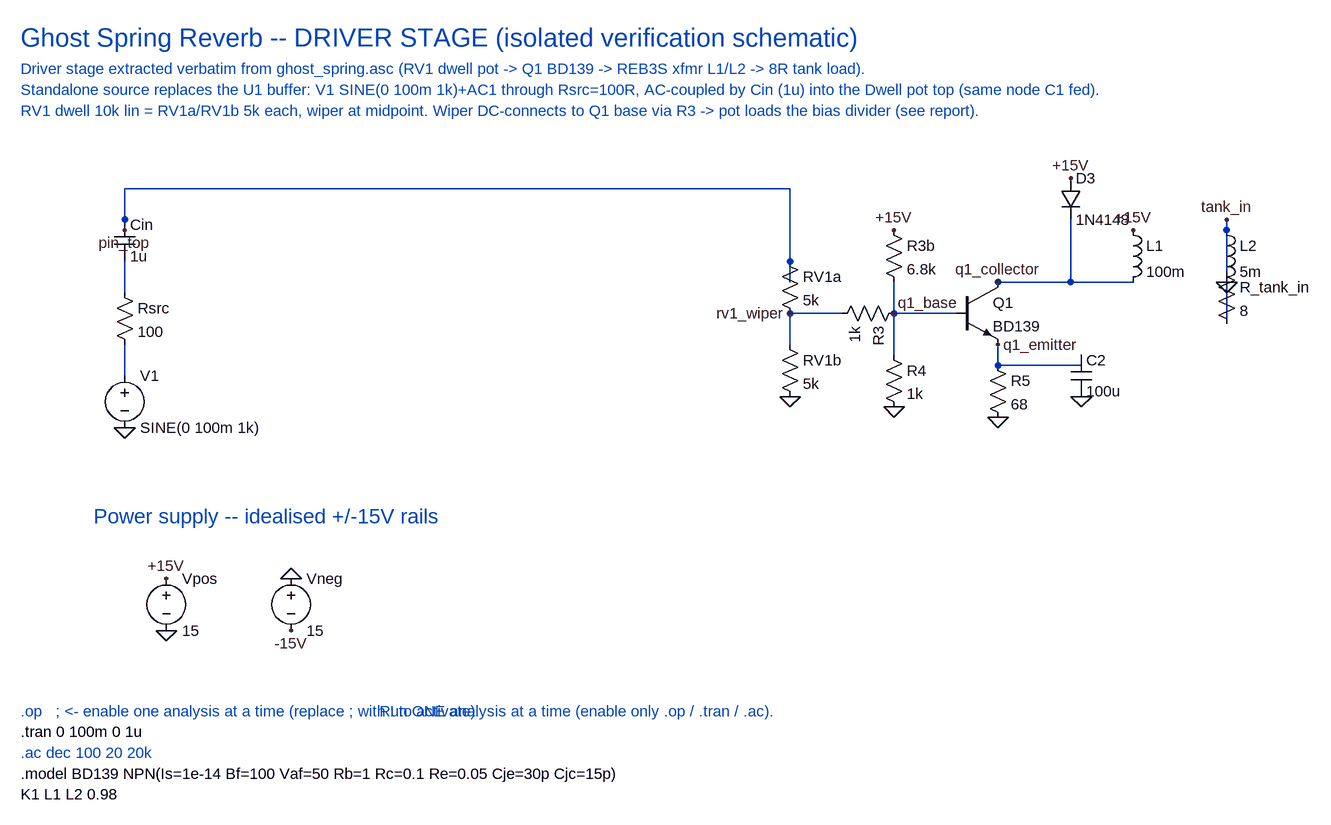
[diagram p0: schematic driver_stage.asc]
driver_stage.asc, the LTspice schematic file:
Version 4
SHEET 1 2400 1200
TEXT 48 24 Left 4 Ghost Spring Reverb -- DRIVER STAGE (isolated verification schematic)
TEXT 48 72 Left 2 Driver stage extracted verbatim from ghost_spring.asc (RV1 dwell pot -> Q1 BD139 -> REB3S xfmr L1/L2 -> 8R tank load).
TEXT 48 104 Left 2 Standalone source replaces the U1 buffer: V1 SINE(0 100m 1k)+AC1 through Rsrc=100R, AC-coupled by Cin (1u) into the Dwell pot top (same node C1 fed).
TEXT 48 136 Left 2 RV1 dwell 10k lin = RV1a/RV1b 5k each, wiper at midpoint. Wiper DC-connects to Q1 base via R3 -> pot loads the bias divider (see report).
SYMBOL cap 192 304 R0
SYMATTR InstName Cin
SYMATTR Value 1u
FLAG 208 320 pin_top
SYMBOL res 192 400 R0
SYMATTR InstName Rsrc
SYMATTR Value 100
SYMBOL voltage 208 528 R0
WINDOW 3 24 96 Left 2
SYMATTR InstName V1
SYMATTR Value SINE(0 100m 1k)
SYMATTR Value2 AC 1
FLAG 208 624 0
WIRE 208 368 208 416
WIRE 208 496 208 544
WIRE 208 320 208 256
WIRE 208 256 1232 256
WIRE 1232 256 1232 368
SYMBOL res 1216 352 R0
SYMATTR InstName RV1a
SYMATTR Value 5k
WIRE 1232 368 1232 400
FLAG 1232 448 rv1_wiper
SYMBOL res 1216 480 R0
SYMATTR InstName RV1b
SYMATTR Value 5k
WIRE 1232 448 1232 496
FLAG 1232 576 0
SYMBOL res 1408 432 R90
SYMATTR InstName R3
SYMATTR Value 1k
WIRE 1232 448 1312 448
FLAG 1392 448 q1_base
SYMBOL res 1376 304 R0
SYMATTR InstName R3b
SYMATTR Value 6.8k
FLAG 1392 320 +15V
WIRE 1392 400 1392 448
SYMBOL res 1376 496 R0
SYMATTR InstName R4
SYMATTR Value 1k
WIRE 1392 448 1392 512
FLAG 1392 592 0
SYMBOL npn 1488 400 R0
SYMATTR InstName Q1
SYMATTR Value BD139
WIRE 1392 448 1488 448
FLAG 1552 496 q1_emitter
FLAG 1552 400 q1_collector
SYMBOL res 1536 512 R0
SYMATTR InstName R5
SYMATTR Value 68
WIRE 1552 496 1552 528
FLAG 1552 608 0
SYMBOL cap 1664 512 R0
SYMATTR InstName C2
SYMATTR Value 100u
WIRE 1552 528 1680 528
WIRE 1680 528 1680 512
FLAG 1680 576 0
SYMBOL diode 1648 240 R0
SYMATTR InstName D3
SYMATTR Value 1N4148
FLAG 1664 240 +15V
WIRE 1664 304 1664 400
WIRE 1552 400 1664 400
SYMBOL ind 1744 304 R0
SYMATTR InstName L1
SYMATTR Value 100m
SYMATTR SpiceLine Rser=0
FLAG 1760 320 +15V
WIRE 1552 400 1760 400
SYMBOL ind 1888 304 R0
SYMATTR InstName L2
SYMATTR Value 5m
SYMATTR SpiceLine Rser=0
FLAG 1904 400 0
FLAG 1904 304 tank_in
WIRE 1904 304 1904 320
SYMBOL res 1888 368 R0
SYMATTR InstName R_tank_in
SYMATTR Value 8
WIRE 1904 320 1904 384
WIRE 1904 464 1904 400
TEXT 160 760 Left 3 Power supply -- idealised +/-15V rails
SYMBOL voltage 272 840 R0
SYMATTR InstName Vpos
SYMATTR Value 15
FLAG 272 856 +15V
FLAG 272 936 0
SYMBOL voltage 464 840 R0
SYMATTR InstName Vneg
SYMATTR Value 15
FLAG 464 856 0
FLAG 464 936 -15V
TEXT 48 1060 Left 2 ;.op   ; <- enable one analysis at a time (replace ; with ! to activate)
TEXT 48 1092 Left 2 !.tran 0 100m 0 1u
TEXT 48 1124 Left 2 ;.ac dec 100 20 20k
TEXT 48 1156 Left 2 !.model BD139 NPN(Is=1e-14 Bf=100 Vaf=50 Rb=1 Rc=0.1 Re=0.05 Cje=30p Cjc=15p)
TEXT 48 1188 Left 2 !K1 L1 L2 0.98
TEXT 600 1060 Left 2 Run ONE analysis at a time (enable only .op / .tran / .ac).

The netlist it stands for:
* driver_stage.asc
Cin pin_top N001 1u
Rsrc N001 N002 100
V1 N002 0 SINE(0 100m 1k) AC 1
RV1a pin_top rv1_wiper 5k
RV1b rv1_wiper 0 5k
R3 q1_base rv1_wiper 1k
R3b +15V q1_base 6.8k
R4 q1_base 0 1k
Q1 q1_collector q1_base q1_emitter 0 BD139
R5 q1_emitter 0 68
C2 q1_emitter 0 100u
D3 +15V q1_collector 1N4148
L1 +15V q1_collector 100m Rser=0
L2 tank_in 0 5m Rser=0
R_tank_in tank_in 0 8
Vpos +15V 0 15
Vneg 0 -15V 15
.model D D
.lib standard.dio
.model NPN NPN
.model PNP PNP
.lib standard.bjt
* Ghost Spring Reverb -- DRIVER STAGE (isolated verification schematic)
* Driver stage extracted verbatim from ghost_spring.asc (RV1 dwell pot -> Q1 BD139 -> REB3S xfmr L1/L2 -> 8R tank load).
* Standalone source replaces the U1 buffer: V1 SINE(0 100m 1k)+AC1 through Rsrc=100R, AC-coupled by Cin (1u) into the Dwell pot top (same node C1 fed).
* RV1 dwell 10k lin = RV1a/RV1b 5k each, wiper at midpoint. Wiper DC-connects to Q1 base via R3 -> pot loads the bias divider (see report).
* Power supply -- idealised +/-15V rails
* .op   ; <- enable one analysis at a time (replace ; with ! to activate)
.tran 0 100m 0 1u
* .ac dec 100 20 20k
.model BD139 NPN(Is=1e-14 Bf=100 Vaf=50 Rb=1 Rc=0.1 Re=0.05 Cje=30p Cjc=15p)
K1 L1 L2 0.98
* Run ONE analysis at a time (enable only .op / .tran / .ac).
.backanno
.end